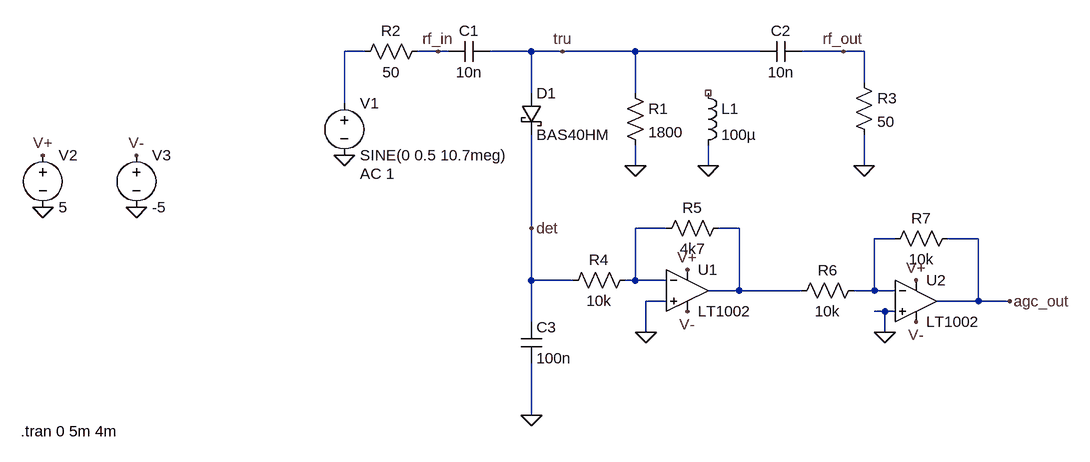
[diagram p0: schematic AGC detector.asc]
AGC detector.asc, the LTspice schematic file:
Version 4
SHEET 1 1168 680
WIRE 64 64 32 64
WIRE 176 64 144 64
WIRE 192 64 176 64
WIRE 320 64 256 64
WIRE 368 64 320 64
WIRE 480 64 368 64
WIRE 672 64 480 64
WIRE 800 64 736 64
WIRE 832 64 800 64
WIRE 832 112 832 64
WIRE 320 128 320 64
WIRE 480 128 480 64
WIRE 32 144 32 64
WIRE 480 240 480 208
WIRE 592 240 592 208
WIRE 832 240 832 192
WIRE 320 336 320 192
WIRE 528 336 480 336
WIRE 640 336 608 336
WIRE 880 352 848 352
WIRE 1008 352 960 352
WIRE 320 416 320 336
WIRE 384 416 320 416
WIRE 480 416 480 336
WIRE 480 416 464 416
WIRE 528 416 480 416
WIRE 640 432 640 336
WIRE 640 432 592 432
WIRE 736 432 640 432
WIRE 848 432 848 352
WIRE 848 432 816 432
WIRE 880 432 848 432
WIRE 528 448 496 448
WIRE 1008 448 1008 352
WIRE 1008 448 944 448
WIRE 1056 448 1008 448
WIRE 864 464 848 464
WIRE 880 464 864 464
WIRE 320 480 320 416
WIRE 496 496 496 448
WIRE 864 496 864 464
WIRE 320 624 320 544
FLAG 32 224 0
FLAG 480 240 0
FLAG 832 240 0
FLAG 320 624 0
FLAG 1056 448 agc_out
FLAG 800 64 rf_out
FLAG 176 64 rf_in
FLAG 320 336 det
FLAG 368 64 tru
FLAG 496 496 0
FLAG 864 496 0
FLAG 560 400 V+
FLAG 912 416 V+
FLAG -432 224 V+
FLAG 560 464 V-
FLAG 912 480 V-
FLAG -288 224 V-
FLAG -432 304 0
FLAG -288 304 0
FLAG 592 240 0
SYMBOL voltage 32 128 R0
WINDOW 123 24 124 Left 2
WINDOW 39 0 0 Left 0
SYMATTR InstName V1
SYMATTR Value SINE(0 0.5 10.7meg)
SYMATTR Value2 AC 1
SYMBOL res 160 48 R90
WINDOW 0 0 56 VBottom 2
WINDOW 3 32 56 VTop 2
SYMATTR InstName R2
SYMATTR Value 50
SYMBOL schottky 304 128 R0
SYMATTR InstName D1
SYMATTR Value BAS40HM
SYMATTR Description Diode
SYMATTR Type diode
SYMBOL cap 256 48 R90
WINDOW 0 0 32 VBottom 2
WINDOW 3 32 32 VTop 2
SYMATTR InstName C1
SYMATTR Value 10n
SYMBOL cap 736 48 R90
WINDOW 0 0 32 VBottom 2
WINDOW 3 32 32 VTop 2
SYMATTR InstName C2
SYMATTR Value 10n
SYMBOL res 464 112 R0
SYMATTR InstName R1
SYMATTR Value 1800
SYMBOL res 816 96 R0
SYMATTR InstName R3
SYMATTR Value 50
SYMBOL cap 304 480 R0
SYMATTR InstName C3
SYMATTR Value 100n
SYMBOL Opamps\\LT1002 560 368 R0
SYMATTR InstName U1
SYMBOL Opamps\\LT1002 912 384 R0
SYMATTR InstName U2
SYMBOL res 480 400 R90
WINDOW 0 0 56 VBottom 2
WINDOW 3 32 56 VTop 2
SYMATTR InstName R4
SYMATTR Value 10k
SYMBOL res 624 320 R90
WINDOW 0 0 56 VBottom 2
WINDOW 3 32 56 VTop 2
SYMATTR InstName R5
SYMATTR Value 4k7
SYMBOL res 832 416 R90
WINDOW 0 0 56 VBottom 2
WINDOW 3 32 56 VTop 2
SYMATTR InstName R6
SYMATTR Value 10k
SYMBOL res 976 336 R90
WINDOW 0 0 56 VBottom 2
WINDOW 3 32 56 VTop 2
SYMATTR InstName R7
SYMATTR Value 10k
SYMBOL voltage -432 208 R0
WINDOW 123 0 0 Left 0
WINDOW 39 0 0 Left 0
SYMATTR InstName V2
SYMATTR Value 5
SYMBOL voltage -288 208 R0
WINDOW 123 0 0 Left 0
WINDOW 39 0 0 Left 0
SYMATTR InstName V3
SYMATTR Value -5
SYMBOL ind 576 112 R0
SYMATTR InstName L1
SYMATTR Value 100µ
TEXT -466 648 Left 2 !.tran 0 5m 4m

The netlist it stands for:
* AGC detector.asc
V1 N001 0 SINE(0 0.5 10.7meg) AC 1
R2 rf_in N001 50
D1 tru det BAS40HM
C1 tru rf_in 10n
C2 rf_out tru 10n
R1 tru 0 1800
R3 rf_out 0 50
C3 det 0 100n
XU1 0 N002 V+ V- N003 LT1002  ; pins In+ In- V+ V- OUT
XU2 0 N004 V+ V- agc_out LT1002  ; pins In+ In- V+ V- OUT
R4 N002 det 10k
R5 N003 N002 4k7
R6 N004 N003 10k
R7 agc_out N004 10k
V2 V+ 0 5
V3 V- 0 -5
L1 NC_01 0 100µ
.model D D
.lib standard.dio
.tran 0 5m 4m
.backanno
.end